# Altium schematic sheet Soil Temperature Sensors.SchDoc: Soil Temperature Sensors
size 292 x 193 mm; SheetNumber: 5; SheetTotal: 5
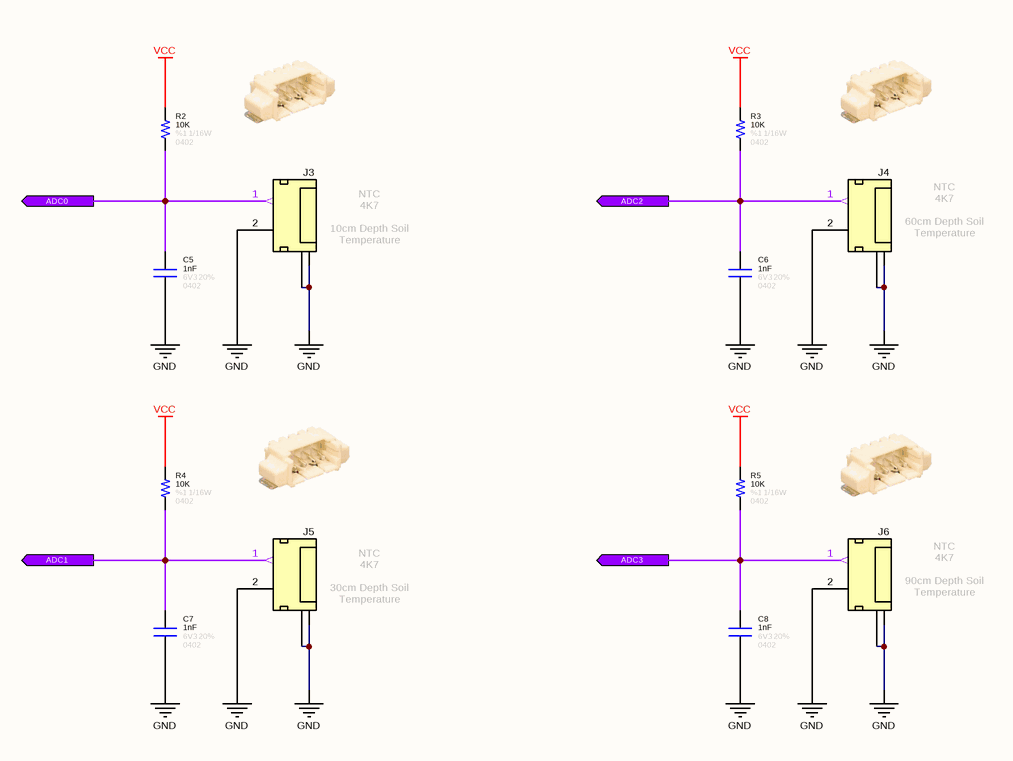
[diagram p0: Soil Temperature Sensors.SchDoc]

## Parts
C5  value 1nF  Tolerance: 20%  Case: 0402  Voltage: 6V3  [CAPACITOR_0402]  (hidden comment: Capacitor - 1nF [0402] (Ceramic))
C6  value 1nF  Tolerance: 20%  Case: 0402  Voltage: 6V3  [CAPACITOR_0402]  (hidden comment: Capacitor - 1nF [0402] (Ceramic))
C7  value 1nF  Tolerance: 20%  Case: 0402  Voltage: 6V3  [CAPACITOR_0402]  (hidden comment: Capacitor - 1nF [0402] (Ceramic))
C8  value 1nF  Tolerance: 20%  Case: 0402  Voltage: 6V3  [CAPACITOR_0402]  (hidden comment: Capacitor - 1nF [0402] (Ceramic))
J3  2P SMD Tunic Connector  [Connector_Tunic 2P]  (value not drawn)
J4  2P SMD Tunic Connector  [Connector_Tunic 2P]  (value not drawn)
J5  2P SMD Tunic Connector  [Connector_Tunic 2P]  (value not drawn)
J6  2P SMD Tunic Connector  [Connector_Tunic 2P]  (value not drawn)
R2  value 10K  Tolerance: %1  Case: 0402  Power: 1/16W  [RESISTOR_0402]  (hidden comment: 10K - 0402 - %1 - 1/16W)
R3  value 10K  Tolerance: %1  Case: 0402  Power: 1/16W  [RESISTOR_0402]  (hidden comment: 10K - 0402 - %1 - 1/16W)
R4  value 10K  Tolerance: %1  Case: 0402  Power: 1/16W  [RESISTOR_0402]  (hidden comment: 10K - 0402 - %1 - 1/16W)
R5  value 10K  Tolerance: %1  Case: 0402  Power: 1/16W  [RESISTOR_0402]  (hidden comment: 10K - 0402 - %1 - 1/16W)

## Ports
ADC0 (out), ADC1 (out), ADC2 (out), ADC3 (out)

## Nets
GND: C5.1 C6.1 C7.1 C8.1 J3.2(Pin2) J3.3(GND) J3.4(GND) J4.2(Pin2) J4.3(GND) J4.4(GND) J5.2(Pin2) J5.3(GND) J5.4(GND) J6.2(Pin2) J6.3(GND) J6.4(GND)
VCC: R2.2 R3.2 R4.2 R5.2
ADC0: C5.2 J3.1(Pin1) R2.1 ; port ADC0
ADC1: C7.2 J5.1(Pin1) R4.1 ; port ADC1
ADC2: C6.2 J4.1(Pin1) R3.1 ; port ADC2
ADC3: C8.2 J6.1(Pin1) R5.1 ; port ADC3

## Notes on the sheet
- (near J3) NTC
  4K7
  10cm Depth Soil Temperature
- (near J4) NTC
  4K7
  60cm Depth Soil Temperature
- (near J5) NTC
  4K7
  30cm Depth Soil Temperature
- (near J6) NTC
  4K7
  90cm Depth Soil Temperature
- © 2021 All rights reserved.
  This document may not, in whole or in part, be copied, photocopied, reproduced, translated or converted to any electronic or machine readable from without prior written permission of Mehmet Günce Akkoyun.
  Engineer contact : akkoyun@me.com
- Property of
- Engineer :
- Date :
- Size :
- A4
- Time :
- Project :
- Page :
- /
- Customer :
- Product ID :
- Module ID :
- Version :
- File :
- Revision :

## Library data of the parts
C5-C8 = Capacitor - 1nF [0402-6V3]: Manufacturer Name: AVX; Manufacturer Part Number: 04026C102MAT2A; ComponentLink1Description: DataSheet; ComponentLink1URL: https://www.mouser.com.tr/datasheet/2/40/X7RDielectric-777024.pdf
J3-J6 = Connector - Mini Tunic 2P (1.25): Mini Tunic Connector with 2P; Manufacturer Name: Molex; Manufacturer Part Number: 53261-0271; Height: 3.55mm; Mouser Part Number: 538-53261-0271; ROHS: Yes
R2-R5 = Resistor - 10K [0402]: Thick Film Resistors - SMD 1/16 W 10 KOhm 1%; Manufacturer Name: Vishay; Manufacturer Part Number: CRCW040210K0FKED; ComponentLink1Description: DataSheet; ComponentLink1URL: https://www.mouser.com.tr/datasheet/2/427/dcrcwe3-1762152.pdf; ComponentLink2Description: Mouser; ComponentLink2URL: https://www.mouser.com.tr/ProductDetail/Vishay-Dale/CRCW040210K0FKED?qs=sGAEpiMZZMu61qfTUdNhG2DpbjADlD3GcalbOv9utCY%3D